# Altium schematic sheet Entry_Protection.SchDoc
size Letter; SheetNumber: 2; SheetTotal: 5
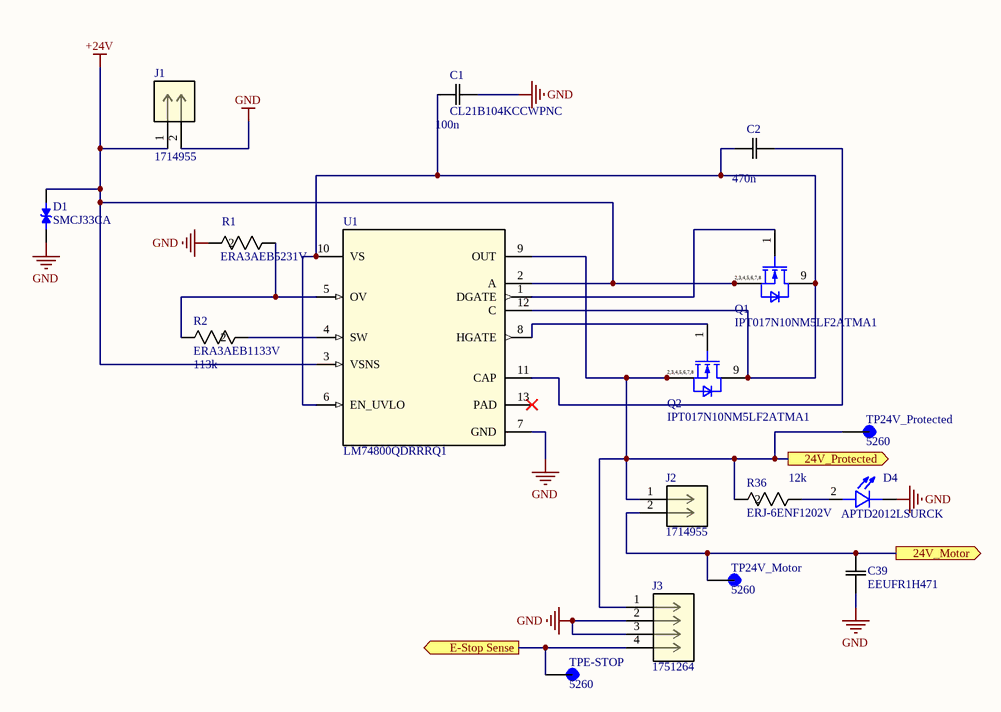
[diagram p0: Entry_Protection.SchDoc]

## Parts
C1  CL21B104KCCWPNC  Capacitor: 100n  [CAP_CL_21_SAM]
C2  Capacitance: 470n  [CAP_2012_TDK]
C39  EEUFR1H471  [CAP_12.5 X 20_PAN]
D1  SMCJ33CA  [DIOM6859X262N]
D4  APTD2012LSURCK  [LED_APTD2012LSURCK]
J1  1714955  [CONN_1714955_PXC]
J2  1714955  [CONN_1714955_PXC]
J3  1751264  [CONN_1751264_PXC]
Q1  IPT017N10NM5LF2ATMA1  [IFX-PG-HSOF-8-1-1-V]
Q2  IPT017N10NM5LF2ATMA1  [IFX-PG-HSOF-8-1-1-V]
R1  ERA3AEB5231V  [RES_ERA3A_0603_PAN]
R2  ERA3AEB1133V  Resistance: 113k  [RES_ERA3A_0603_PAN]
R36  ERJ-6ENF1202V  Resistance: 12k  [RC0805N_PAN]
TP24V_Motor  5260  [KEYSTONE_5260]
TP24V_Protected  5260  [KEYSTONE_5260]
TPE-STOP  5260  [KEYSTONE_5260]
U1  LM74800QDRRRQ1  [DRR0012E]

## Ports
24V_Motor (out, see Overall_Schematic[1A], Ｄｒｉｖｅｒｓ[1A]), 24V_Protected (out, see Overall_Schematic[1A], MC[1A]), E-Stop Sense (out, see Overall_Schematic[1A], MC[2B])

## Nets
+24V: D1.2 J1.1 Q1.2(SOURCE) Q1.3(SOURCE) Q1.4(SOURCE) Q1.5(SOURCE) Q1.6(SOURCE) Q1.7(SOURCE) Q1.8(SOURCE) U1.2(A) U1.3(VSNS)
GND: C1.2 C39.2 D1.1 D4.1(C) J1.2 J3.2 J3.3 R1.2 U1.7(GND)
24V_Motor: C39.1 J2.2 TP24V_Motor.1(TP) ; port 24V_Motor
24V_Protected: J2.1 J3.1 Q2.2(SOURCE) Q2.3(SOURCE) Q2.4(SOURCE) Q2.5(SOURCE) Q2.6(SOURCE) Q2.7(SOURCE) Q2.8(SOURCE) R36.2 TP24V_Protected.1(TP) U1.9(OUT) ; port 24V_Protected
E-Stop Sense: J3.4 TPE-STOP.1(TP) ; port E-Stop Sense
NetC1_1: C1.1 C2.1 Q1.9(DRAIN) Q2.9(DRAIN) U1.6(EN_UVLO) U1.10(VS) U1.12(C)
NetC2_2: C2.2 U1.11(CAP)
NetD4_2: D4.2(A) R36.1
NetQ1_1: Q1.1(GATE) U1.1(DGATE)
NetQ2_1: Q2.1(GATE) U1.8(HGATE)
NetR1_1: R1.1 R2.1 U1.5(OV)
NetR2_2: R2.2 U1.4(SW)

Not connected (* = marked no-connect by the designer): U1 13(PAD)*

## Notes on the sheet
- (in symbol IPT017N10NM5LF2) 2,3,4,5,6,7,8

## Library data of the parts
C1 = CL21B104KCCWPNC: No Description Available; Manufacturer_Name: Samsung; Copyright: Copyright (C) 2026 Ultra Librarian. All rights reserved.; Manufacturer_Part_Number: CL21B104KCCWPNC
C2 = C2012X7R1H474K125AB: No Description Available; Manufacturer_Name: TDK; Copyright: Copyright (C) 2026 Ultra Librarian. All rights reserved.; Manufacturer_Part_Number: C2012X7R1H474K125AB
C39 = EEUFR1H471: Description; Manufacturer_Name: Panasonic; Copyright: Copyright (C) 2025 Ultra Librarian. All rights reserved.; Manufacturer_Part_Number: EEUFR1H471
D1 = CMP-004-00031-1: Availability: Unavailable; Case/Package: None; Price: None; Source: SMCJ33CA.SchLib; Value: *; Pins: 2; Component Type: Standard; Design Item ID: SMCJ33CA; MP: SMCJ33CA
D4 = CMP-005-000000-1: Red 630nm LED Indication - Discrete 1.75V 0805 (2012 Metric); MF: Kingbright; Design Item ID: APTD2012LSURCK; SnapEDA_Link: https://www.snapeda.com/parts/APTD2012LSURCK/Kingbright/view-part/?ref=snap; Component Type: Standard; Check_prices: https://www.snapeda.com/parts/APTD2012LSURCK/Kingbright/view-part/?ref=eda; Pin Count: 2; Package: 0805 Kingbright; MP: APTD2012LSURCK; Source: APTD2012LSURCK.SchLib; Value: *
J1 J2 = 1714955: PCB terminal block, nominal current: 32 A, rated voltage (III/2): 630 V, nominal cross section: 4 mmÂ², number of potentials: 2, number of rows: 1, number of positions per row: 2, product range: MKDS 5, pitch: 6.35 mm, connection method: Screw connection with tension sleeve, screw head form: L Slotted, mounting: Wave soldering, conductor/PCB connection direction: 0 Â°, color: green, Pin layout: Linear pinning, Solder pin [P]: 5.1 mm, number of solder pins per potential: 1, type of packaging: packed in cardboard. The article can be aligned to create different nos. of positions!; Manufacturer_Name: Phoenix Contact; Copyright: Copyright (C) 2025 Ultra Librarian. All rights reserved.; Manufacturer_Part_Number: 1714955; RefDes: RefDes; Type: Type
J3 = 1751264: PCB terminal block, nominal current: 17.5 A, rated voltage (III/2): 200 V, nominal cross section: 1.5 mmÂ², number of potentials: 4, number of rows: 1, number of positions per row: 4, product range: MKDS 1, pitch: 3.5 mm, connection method: Screw connection with tension sleeve, screw head form: L Slotted, mounting: Wave soldering, conductor/PCB connection direction: 0 Â°, color: green, Pin layout: Linear pinning, Solder pin [P]: 3.5 mm, number of solder pins per potential: 1, type of packaging: packed in cardboard. Suitable for CAT5; Manufacturer_Name: Phoenix Contact; Copyright: Copyright (C) 2025 Ultra Librarian. All rights reserved.; Manufacturer_Part_Number: 1751264; RefDes: RefDes; Type: Type
Q1 Q2 = IPT017N10NM5LF2: Insulated-Gate Field-Effect Transistor (IGFET), N-Channel, Enhancement, Body Diode, Pin 1 Gate, 2-8 Source, 9 Drain, 9 Pins; Manufacturer: Infineon Technologies; Manufacturer Order Number: IPT017N10NM5LF2; PackageReference: PG-HSOF-8-1
R1 = ERA3AEB5231V: Description; Manufacturer_Name: Panasonic; Copyright: Copyright (C) 2026 Ultra Librarian. All rights reserved.; Manufacturer_Part_Number: ERA3AEB5231V
R2 = ERA3AEB1133V: No Description Available; Manufacturer_Name: Panasonic; Copyright: Copyright (C) 2026 Ultra Librarian. All rights reserved.; Manufacturer_Part_Number: ERA3AEB1133V
R36 = ERJ-6ENF1202V: Description; Manufacturer_Name: Panasonic; Copyright: Copyright (C) 2026 Ultra Librarian. All rights reserved.; Manufacturer_Part_Number: ERJ-6ENF1202V
TP24V_Motor TP24V_Protected TPE-STOP = CMP-007-000000-1: TEST POINT (RED) - MINIATURE; MF: Keystone Electronics; MP: 5260; Source: 5260.SchLib; Check_prices: https://www.snapeda.com/parts/5260/Keystone/view-part/?ref=eda; SnapEDA_Link: https://www.snapeda.com/parts/5260/Keystone/view-part/?ref=snap; Package: None; Pin Count: 1; Value: *; Design Item ID: 5260; Component Type: Standard
U1 = LM74800QDRRRQ1: 3-V to 65-V, automotive ideal diode controller driving back to back NFETs 12-WSON -40 to 125; Manufacturer_Name: Texas Instruments; TYPE: TYPE; RefDes: RefDes; Copyright: Copyright (C) 2026 Ultra Librarian. All rights reserved.; Manufacturer_Part_Number: LM74800QDRRRQ1